# Altium schematic sheet CPCIS_Connectors_P1_P6.SchDoc: DIOT Connector
size 420 x 297 mm; DrawnBy: G.K.; Organization: WUT; DocumentNumber: 1; SheetNumber: 6; SheetTotal: 10; ModifiedBy: M. Beldyga; Title2: CPCIS Connectors; Designer: G.K.; SPICEModelCacheRMUUFYQV: <root> / <DocumentId>RMUUFYQV</DocumentId> / </root>; ModifiedDate: -; Rule: PcbType=ProtelPcb
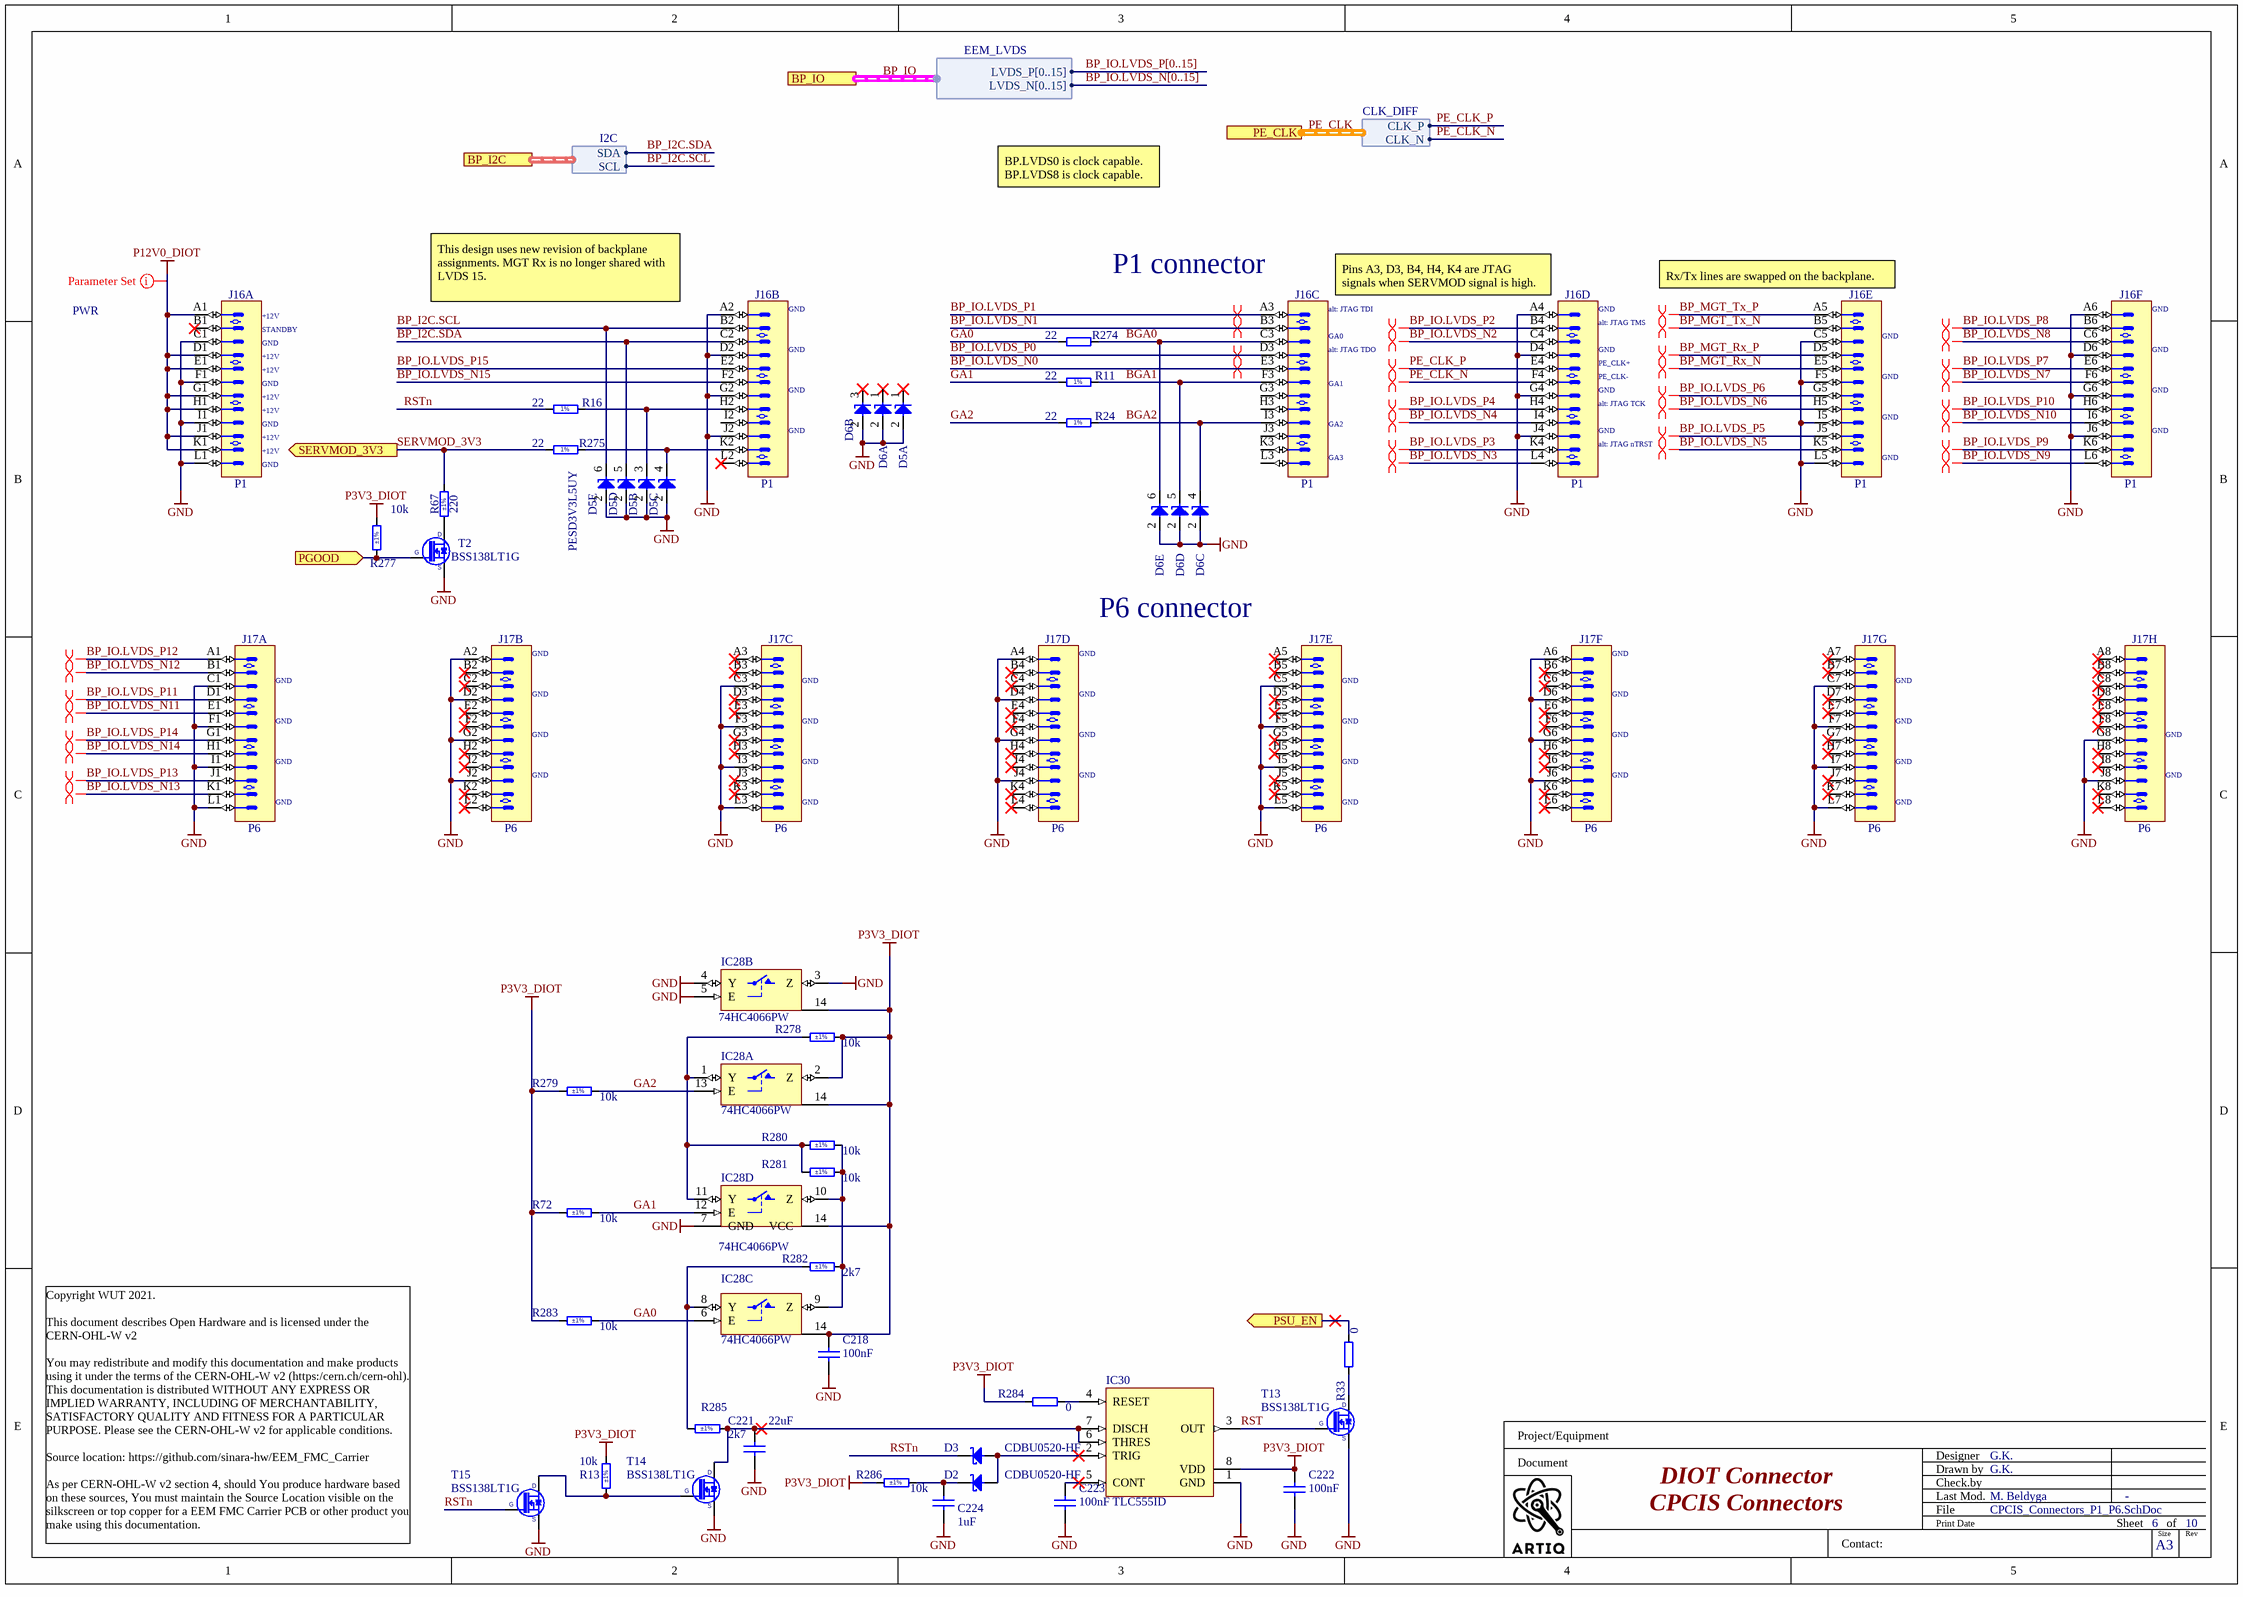
[diagram p0: CPCIS_Connectors_P1_P6.SchDoc]

## Parts
C218  100nF  [CAPC1608X87N]
C221  22uF  [CAPC2012X135N]
C222  100nF  [CAPC1608X87N]
C223  100nF  [CAPC1608X87N]
C224  1uF  [CAPC1608X87N]
D2  CDBU0520-HF  [SOD-523F]
D3  CDBU0520-HF  [SOD-523F]
D5  PESD3V3L5UY  [SOT65P210X110-6N]  (value not drawn)  (parts A,B,C,D,E of 5)
D6  PESD3V3L5UY  [SOT65P210X110-6N]  (value not drawn)  (parts A,B,C,D,E of 5)
IC28  74HC4066PW  [SOP65P640X110-14N]  (parts A,B,C,D of 4)
IC30  TLC555ID  [SOIC127P600X175-8N]
J16  P1  [AMPHENOL_10052825-101LF]  (parts A,B,C,D,E,F of 6)
J17  P6  [AMPHENOL_10052838-101LF]  (parts A,B,C,D,E,F,G,H of 8)
R11  22  [RESC1005X40N]
R13  10k  Tolerance: ±1%  [RESC1608X55N]
R16  22  [RESC1005X40N]
R24  22  [RESC1005X40N]
R33  0  [RESC1608X55N]
R67  220  Tolerance: ±1%  [RESC1005X40N]
R72  10k  Tolerance: ±1%  [RESC1608X55N]
R274  22  [RESC1005X40N]
R275  22  [RESC1005X40N]
R277  10k  Tolerance: ±1%  [RESC1608X55N]
R278  10k  Tolerance: ±1%  [RESC1608X55N]
R279  10k  Tolerance: ±1%  [RESC1608X55N]
R280  10k  Tolerance: ±1%  [RESC1608X55N]
R281  10k  Tolerance: ±1%  [RESC1608X55N]
R282  2k7  Tolerance: ±1%  [RESC1608X55N]
R283  10k  Tolerance: ±1%  [RESC1608X55N]
R284  0  [RESC1608X55N]
R285  2k7  Tolerance: ±1%  [RESC1608X55N]
R286  10k  Tolerance: ±1%  [RESC1608X55N]
T2  BSS138LT1G  [SOT95P240X110-3N]
T13  BSS138LT1G  [SOT95P240X110-3N]
T14  BSS138LT1G  [SOT95P240X110-3N]
T15  BSS138LT1G  [SOT95P240X110-3N]

## Ports
BP_I2C (harness I2C), BP_IO (harness EEM_LVDS), PE_CLK (harness CLK_DIFF), PGOOD (in), PSU_EN (out), SERVMOD_3V3 (out)

## Harnesses
CLK_DIFF: CLK_N, CLK_P
I2C: SDA, SCL
EEM_LVDS: LVDS_P[0..15], LVDS_N[0..15]

## Nets
GND: C218.1 C221.1 C222.1 C223.1 C224.1 D5.2(A) D6.2(A) IC28.3(Z) IC28.4(Y) IC28.5(E) IC28.7(GND) IC30.1(GND) J16.A2 J16.A4 J16.A6 J16.C1 J16.C5 J16.D2 J16.D4 J16.D6 J16.F1 J16.F5 J16.G2 J16.G4 J16.G6 J16.I1 J16.I5 J16.J2 J16.J4 J16.J6 J16.L1 J16.L5 J17.A2 J17.A4 J17.A6 J17.C1 J17.C3 J17.C5 J17.C7 J17.D2 J17.D4 J17.D6 J17.F1 J17.F3 J17.F5 J17.F7 J17.G2 J17.G4 J17.G6 J17.G8 J17.I1 J17.I3 J17.I5 J17.I7 J17.J2 J17.J4 J17.J6 J17.J8 J17.L1 J17.L3 J17.L5 J17.L7 T2.2(S) T13.2(S) T14.2(S) T15.2(S)
P3V3_DIOT: C218.2 C222.2 IC28.2(Z) IC28.14(VCC) IC30.8(VDD) R13.2 R72.1 R277.2 R278.2 R279.1 R283.1 R284.1 R286.1
P12V0_DIOT: J16.A1 J16.D1 J16.E1 J16.G1 J16.H1 J16.J1 J16.K1
BGA0: D6.6(C) J16.C3 R274.2
BGA1: D6.5(C) J16.F3 R11.2
BGA2: D6.4(C) J16.I3 R24.2
BP_I2C.SCL: D5.6(C) J16.B2 ; port BP_I2C.SCL
BP_I2C.SDA: D5.5(C) J16.C2 ; port BP_I2C.SDA
BP_IO.LVDS_N0: J16.E3
BP_IO.LVDS_N1: J16.B3
BP_IO.LVDS_N2: J16.C4
BP_IO.LVDS_N3: J16.L4
BP_IO.LVDS_N4: J16.I4
BP_IO.LVDS_N5: J16.K5
BP_IO.LVDS_N6: J16.H5
BP_IO.LVDS_N7: J16.F6
BP_IO.LVDS_N8: J16.C6
BP_IO.LVDS_N9: J16.L6
BP_IO.LVDS_N10: J16.I6
BP_IO.LVDS_N11: J17.E1
BP_IO.LVDS_N12: J17.B1
BP_IO.LVDS_N13: J17.K1
BP_IO.LVDS_N14: J17.H1
BP_IO.LVDS_N15: J16.F2
BP_IO.LVDS_P0: J16.D3
BP_IO.LVDS_P1: J16.A3
BP_IO.LVDS_P2: J16.B4
BP_IO.LVDS_P3: J16.K4
BP_IO.LVDS_P4: J16.H4
BP_IO.LVDS_P5: J16.J5
BP_IO.LVDS_P6: J16.G5
BP_IO.LVDS_P7: J16.E6
BP_IO.LVDS_P8: J16.B6
BP_IO.LVDS_P9: J16.K6
BP_IO.LVDS_P10: J16.H6
BP_IO.LVDS_P11: J17.D1
BP_IO.LVDS_P12: J17.A1
BP_IO.LVDS_P13: J17.J1
BP_IO.LVDS_P14: J17.G1
BP_IO.LVDS_P15: J16.E2
BP_MGT_Rx_N: J16.E5
BP_MGT_Rx_P: J16.D5
BP_MGT_Tx_N: J16.B5
BP_MGT_Tx_P: J16.A5
GA0: IC28.6(E) R274.1 R283.2
GA1: IC28.12(E) R11.1 R72.2
GA2: IC28.13(E) R24.1 R279.2
PE_CLK_N: J16.F4 ; port PE_CLK.CLK_N  [project net PE_CLK.CLK_N]
PE_CLK_P: J16.E4 ; port PE_CLK.CLK_P  [project net PE_CLK.CLK_P]
PGOOD: R277.1 T2.1(G) ; port PGOOD
PSU_EN: R33.2 ; port PSU_EN
RST: IC30.3(OUT) T13.1(G)
RSTn: D3.1(C) R16.1 T15.1(G)
SERVMOD_3V3: R67.2 R275.1 ; port SERVMOD_3V3
NetC221_2: C221.2 IC30.6(THRES) IC30.7(DISCH) R285.2 T14.3(D)
NetC223_2: C223.2 IC30.5(CONT)
NetC224_2: C224.2 D2.1(C) R286.2
NetD2_2: D2.2(A) D3.2(A) IC30.2(TRIG)
NetD5_3: D5.3(C) J16.H2 R16.2
NetD5_4: D5.4(C) J16.K2 R275.2
NetIC28_1: IC28.1(Y) IC28.11(Y) R278.1 R280.1 R281.1
NetIC28_8: IC28.8(Y) R282.1 R285.1
NetIC28_9: IC28.9(Z) IC28.10(Z) R280.2 R281.2 R282.2
NetIC30_4: IC30.4(RESET) R284.2
NetR13_1: R13.1 T14.1(G) T15.3(D)
NetR33_1: R33.1 T13.3(D)
NetR67_1: R67.1 T2.3(D)

Not connected (* = marked no-connect by the designer): D5 1(C)*; D6 1(C)* 3(C)*; J16 B1* G3 H3 I2 J3 K3 L2* L3; J17 A3* A5* A7* A8* B2* B3* B4* B5* B6* B7* B8* C2* C4* C6* C8* D3* D5* D7* D8* E2* E3* E4* E5* E6* E7* E8* F2* F4* F6* F8* G3* G5* G7* H2* H3* H4* H5* H6* H7* H8* I2* I4* I6* I8* J3* J5* J7* K2* K3* K4* K5* K6* K7* K8* L2* L4* L6* L8*

## Buses and harness runs
bus BP_IO.LVDS_N[0..15]
bus BP_IO.LVDS_P[0..15]
harness BP_IO = port BP_IO
harness PE_CLK = port PE_CLK

## Layout directives
differential pair: BP_IO.LVDS_N0, BP_IO.LVDS_N1, BP_IO.LVDS_N2, BP_IO.LVDS_N3, BP_IO.LVDS_N4, BP_IO.LVDS_N5, BP_IO.LVDS_N6, BP_IO.LVDS_N7, BP_IO.LVDS_N8, BP_IO.LVDS_N9, BP_IO.LVDS_N10, BP_IO.LVDS_N11, BP_IO.LVDS_N12, BP_IO.LVDS_N13, BP_IO.LVDS_N14, BP_IO.LVDS_P0, BP_IO.LVDS_P1, BP_IO.LVDS_P2, BP_IO.LVDS_P3, BP_IO.LVDS_P4, BP_IO.LVDS_P5, BP_IO.LVDS_P6, BP_IO.LVDS_P7, BP_IO.LVDS_P8, BP_IO.LVDS_P9, BP_IO.LVDS_P10, BP_IO.LVDS_P11, BP_IO.LVDS_P12, BP_IO.LVDS_P13, BP_IO.LVDS_P14
differential pair; differential pair class Diff_100Ohm: PE_CLK.CLK_N, PE_CLK.CLK_P
differential pair; differential pair class MGT: BP_MGT_Rx_N, BP_MGT_Rx_P, BP_MGT_Tx_N, BP_MGT_Tx_P
net class PWR: P12V0_DIOT

## Notes on the sheet
- BP.LVDS0 is clock capable.
  BP.LVDS8 is clock capable.
- (near J16) +12V
- This design uses new revision of backplane assignments. MGT Rx is no longer shared with LVDS 15.
- (near J16) GND
- (near J16) P1 connector
- (near J16) alt: JTAG TDI
- (near J16) Pins A3, D3, B4, H4, K4 are JTAG signals when SERVMOD signal is high.
- (near J16) alt: JTAG TMS
- (near J16) Rx/Tx lines are swapped on the backplane.
- (near J16) STANDBY
- GND
- (near J16) alt: JTAG TDO
- (near J16) GA1
- (near J16) GA0
- (near J16) PE_CLK+
- (near J16) PE_CLK-
- (near J16) GA2
- (near J16) GA3
- (near J16) alt: JTAG TCK
- (near J16) alt: JTAG nTRST
- (near J17) GND
- (near J17) P6 connector
- Project/Equipment
- Document
- Designer
- Drawn by
- Check.by
- Copyright WUT 2021.
  This document describes Open Hardware and is licensed under the CERN-OHL-W v2
  You may redistribute and modify this documentation and make products using it under the terms of the CERN-OHL-W v2 (https:/cern.ch/cern-ohl). This documentation is distributed WITHOUT ANY EXPRESS OR IMPLIED WARRANTY, INCLUDING OF MERCHANTABILITY, SATISFACTORY QUALITY AND FITNESS FOR A PARTICULAR PURPOSE. Please see the CERN-OHL-W v2 for applicable conditions.
  Source location: https://github.com/sinara-hw/EEM_FMC_Carrier
  As per CERN-OHL-W v2 section 4, should You produce hardware based on these sources, You must maintain the Source Location visible on the silkscreen or top copper for a EEM FMC Carrier PCB or other product you make using this documentation.
- Contact:
- File
- Last Mod.
- Print Date
- Sheet
- Size
- A3
- of
- Rev
- (in symbol R0402_22R_1%_0.0625W_100PPM) 1%

## Library data of the parts
C218 C222 C223 = CC0603_100NF_50V_10%_X7R: Non-polarised capacitor; Part Description: SMD Multilayer Chip Ceramic Capacitor; Manufacturer: GENERIC; Manufacturer1 Part Number: 223858615649; Voltage: 50V; TC: X7R; Tolerance: ±10%; Part Number: CC0603_100NF_50V_10%_X7R; Component Kind: Standard; Component Type: Standard; Pin Count: 2; Value: 100nF; Status: Preferred; Manufacturer Part Number: CC0603_100NF_50V_10%_X7R; Case: 0603; Mounted: Yes; Socket: No; SMD: Yes; Sense: No; Manufacturer1 Example: PHYCOMP; Manufacturer1 ComponentHeight: 0.87mm; HelpURL: \\cern.ch\dfs\Applications\Altium\Datasheets\CC0603_X7R_PHYCOMP.pdf; Author: CERN DEM JLC; CreateDate: 03.12.2007; LatestRevisionDate: 03.12.2007
C221 = CC0805_22UF_16V_10%_X5R: Non-polarised capacitor; Part Description: SMD Multilayer Chip Ceramic Capacitor; Manufacturer: GENERIC; Manufacturer1 Part Number: C2012X5R1C226KT; Voltage: 16V; TC: X5R; Tolerance: ±10%; Part Number: CC0805_22UF_16V_10%_X5R; Component Kind: Standard; Component Type: Standard; Pin Count: 2; Value: 22uF; Status: Preferred; Manufacturer Part Number: CC0805_22UF_16V_10%_X5R; Case: 0805; Mounted: Yes; Socket: No; SMD: Yes; Sense: No; Manufacturer1 Example: TDK; Manufacturer1 ComponentHeight: 1.35mm; HelpURL: \\cern.ch\dfs\Applications\Altium\Datasheets\CC0805_X5R_TDK_C.pdf; Author: CERN DEM JLC; CreateDate: 25.10.2012; LatestRevisionDate: 25.10.2012
C224 = CC0603_1UF_16V_10%_X7R: Non-polarised capacitor; Part Description: SMD Multilayer Chip Ceramic Capacitor; Manufacturer: GENERIC; Manufacturer1 Part Number: 223878615663; Voltage: 16V; TC: X7R; Tolerance: ±10%; Part Number: CC0603_1UF_16V_10%_X7R; Component Kind: Standard; Component Type: Standard; Pin Count: 2; Value: 1uF; Status: None; Manufacturer Part Number: CC0603_1UF_16V_10%_X7R; Case: 0603; Mounted: Yes; Socket: No; SMD: Yes; Sense: No; Manufacturer1 Example: YAGEO PHYCOMP; Manufacturer1 ComponentHeight: 0.9mm; HelpURL: \\cern.ch\dfs\Applications\Altium\Datasheets\CC0603_X7R_PHYCOMP.pdf; Author: CERN DEM JLC; CreateDate: 03.12.2007; LatestRevisionDate: 17.04.2015
D2 D3 = CDBU0520-HF: Schottky Diode; Part Description: 20V Surface mount Schottky Barrier Diode; Manufacturer: COMCHIP; Voltage: 20V; Power: 500mA; PressFit: No; Bonding: No; Part Number: CDBU0520-HF; Component Kind: Standard; Component Type: Standard; Device: CDBU0520-HF; PackageDescription: Small Outline Diode Flat Lead (SOD-523F), Body; 1.80mm L X 1mm W X 0.85mm H; Manufacturer Part Number: CDBU0520-HF; Pin Count: 2; Case: SOD-523F; Mounted: Yes; Socket: No; SMD: Yes; Sense: No; ComponentHeight: 1mm; HelpURL: \\cern.ch\dfs\Applications\Altium\Datasheets\CDBU0520-HF.pdf; Author: CERN DEM HF; CreateDate: 13.10.2023; LatestRevisionDate: 13.10.2023
D5 D6 = PESD3V3L5UY: Fivefold ESD Protection Diode Arrays; Part Description: Fivefold ESD Protection Diode Arrays (30kV); Manufacturer: NEXPERIA; Voltage: 3.3V; Power: 200W; PressFit: No; Bonding: No; Part Number: PESD3V3L5UY; Component Kind: Standard; Component Type: Standard; Device: PESD3V3L5UY; PackageDescription: SOT363, SC-88, 0.65mm Pitch; 6 Pin, 1.25mm W X 2.00mm L X 1.10mm H body, IPC Medium Density; Manufacturer Part Number: PESD3V3L5UY; Pin Count: 6; Case: SOT363; Mounted: Yes; Socket: No; SMD: Yes; Sense: No; ComponentHeight: 1.1mm; HelpURL: \\cern.ch\dfs\Applications\Altium\Datasheets\PESD3V3L5UY.pdf; Author: CERN DEM WB; CreateDate: 05.07.2021; LatestRevisionDate: 05.07.2021
IC28 = 74HC4066PW: Part Description: Quad Single-Pole Single-Throw Analog Switch; Manufacturer: NXP SEMICONDUCTORS; PressFit: No; Bonding: No; Table: Standard Logic; Part Number: 74HC4066PW; Component Kind: Standard; Component Type: Standard; Device: 74HC4066PW; PackageDescription: SOP, 14-Leads, Body 4.4x5mm (max), Pitch 0.65mm, IPC Medium Density; Manufacturer Part Number: 74HC4066PW; Pin Count: 14; Case: TSSOP14; Mounted: Yes; Socket: No; SMD: Yes; ComponentHeight: 1.1mm; Author: CERN DEM JLC; HelpURL: \\cern.ch\dfs\Applications\Altium\Datasheets\74HC4066PW.pdf; CreateDate: 2014-11-19; LatestRevisionDate: 2014-11-19
IC30 = TLC555ID: LinCMOS Timer; Manufacturer: TEXAS INSTRUMENTS; PressFit: No; Bonding: No; Part Number: TLC555ID; Component Kind: Standard; Component Type: Standard; Device: TLC555ID; PackageDescription: SOIC 8, Pitch 1.27mm, Body 4x5mm, IPC Medium Density; Part Description: LinCMOS Timer; Manufacturer Part Number: TLC555ID; Pin Count: 8; Case: SOIC8; Mounted: Yes; Socket: No; SMD: Yes; Sense: No; ComponentHeight: 1.75mm; Author: CERN DEM JMW; HelpURL: \\cern.ch\dfs\Applications\Altium\Datasheets\TLC555ID.pdf; CreateDate: 23.08.2016; LatestRevisionDate: 23.08.2016
J16 = AMPHENOL_10052825-101LF: 72 Contacts Header, 6 Columns, 4 Pairs per Column; Part Description: 72 Contacts, 2mm Pitch, 6 Columns, 4 Pairs per Column, 4 Walls, Right Angle Header; Part Number: AMPHENOL_10052825-101LF; Component Kind: Standard; Component Type: Standard; Pin Count: 72; Family: AirMax VS; Mounted: Yes; Socket: No; SMD: No; PressFit: Yes; Sense: No; Status: None; Manufacturer: AMPHENOL; Manufacturer Part Number: 10052825-101LF; ComponentHeight: 15.35mm; HelpURL: \\cern.ch\dfs\Applications\Altium\Datasheets\AMPHENOL_10052825-101LF.pdf; ComponentLink1URL: \\cern.ch\dfs\Applications\Altium\Datasheets\AMPHENOL_10052825-101LF_Application.pdf; ComponentLink1Description: Application; Author: CERN DEM MR; CreateDate: 19/02/2018; LatestRevisionDate: 19/02/2018; Classname: Overlapping
J17 = AMPHENOL_10052838-101LF: 96 Contacts Header, 8 Columns, 4 Pairs per Column; Part Description: 96 Contacts, 2mm Pitch, 8 Columns, 4 Pairs per Column, 4 Walls, Right Angle Header; Part Number: AMPHENOL_10052838-101LF; Component Kind: Standard; Component Type: Standard; Pin Count: 96; Family: AirMax VS; Mounted: Yes; Socket: No; SMD: No; PressFit: Yes; Sense: No; Status: None; Manufacturer: AMPHENOL; Manufacturer Part Number: 10052838-101LF; ComponentHeight: 15.35mm; HelpURL: \\cern.ch\dfs\Applications\Altium\Datasheets\AMPHENOL_10052838-101LF.pdf; ComponentLink1URL: \\cern.ch\dfs\Applications\Altium\Datasheets\AMPHENOL_10052838-101LF_Application.pdf; ComponentLink1Description: Application; Author: CERN DEM MR; CreateDate: 19.02.2018; LatestRevisionDate: 19.02.2018
R11 R16 R24 R274 R275 = R0402_22R_1%_0.0625W_100PPM: Resistor - 1%; Part Description: General Purpose Thick Film Chip Resistor; Manufacturer: GENERIC; Manufacturer1 Part Number: 232270672209L; PressFit: No; Part Number: R0402_22R_1%_0.0625W_100PPM; Component Kind: Standard; Component Type: Standard; Pin Count: 2; Value: 22; Status: Not Recommended; Power: 0.0625W; Tolerance: ±1%; Manufacturer Part Number: R0402_22R_1%_0.0625W_100PPM; Case: 0402; Mounted: Yes; Socket: No; SMD: Yes; Manufacturer1 Example: YAGEO PHYCOMP; Manufacturer1 ComponentHeight: 0.4mm; HelpURL: \\cern.ch\dfs\Applications\Altium\Datasheets\R0402_Phycomp_RC0402.pdf; Author: CERN DEM JLC; CreateDate: 03.12.2007; LatestRevisionDate: 17.10.2012; Sense: No
R13 R72 R277-R281 R283 R286 = R0603_10K_1%_0.1W_100PPM: Resistor - 1%; Part Description: General Purpose Thick Film Chip Resistor; Manufacturer: GENERIC; Manufacturer1 Part Number: NRC06F1002TRF; Power: 0.1W; TC: ±100ppm/°C; PressFit: No; Part Number: R0603_10K_1%_0.1W_100PPM; Component Kind: Standard; Component Type: Standard; Pin Count: 2; Value: 10k; Status: Preferred; Manufacturer Part Number: R0603_10K_1%_0.1W_100PPM; Case: 0603; Mounted: Yes; Sense: No; Socket: No; SMD: Yes; Manufacturer1 Example: NIC COMPONENT; Manufacturer1 ComponentHeight: 0.55mm; HelpURL: \\cern.ch\dfs\Applications\Altium\Datasheets\R0603_NIC_NRC.pdf; Author: CERN DEM JLC; CreateDate: 03.12.2007; LatestRevisionDate: 13.03.2008
R33 R284 = R0603_0R_JUMPER: Resistor; Part Description: 1A (0.05R Max DC Resistance) Zero Ohm Jumper; Manufacturer: GENERIC; Manufacturer1 Part Number: NRC06Z0; PressFit: No; Part Number: R0603_0R_JUMPER; Component Kind: Standard; Component Type: Standard; Pin Count: 2; Value: 0; Status: Preferred; Manufacturer Part Number: R0603_0R_JUMPER; Case: 0603; Mounted: Yes; Sense: No; Socket: No; SMD: Yes; Manufacturer1 Example: NIC COMPONENT; Manufacturer1 ComponentHeight: 0.55mm; HelpURL: \\cern.ch\dfs\Applications\Altium\Datasheets\R0603_NIC_NRC.pdf; Author: CERN DEM JLC; CreateDate: 03.12.2007; LatestRevisionDate: 13.03.2008
R67 = R0402_220R_1%_0.0625W_100PPM: Resistor - 1%; Part Description: General Purpose Thick Film Chip Resistor; Manufacturer: GENERIC; Manufacturer1 Part Number: 232270672201L; TC: ±100ppm/°C; PressFit: No; Part Number: R0402_220R_1%_0.0625W_100PPM; Component Kind: Standard; Component Type: Standard; Pin Count: 2; Value: 220; Status: Not Recommended; Power: 0.0625W; Manufacturer Part Number: R0402_220R_1%_0.0625W_100PPM; Case: 0402; Mounted: Yes; Sense: No; Socket: No; SMD: Yes; Manufacturer1 Example: YAGEO PHYCOMP; Manufacturer1 ComponentHeight: 0.4mm; HelpURL: \\cern.ch\dfs\Applications\Altium\Datasheets\R0402_Phycomp_RC0402.pdf; Author: CERN DEM JLC; CreateDate: 03.12.2007; LatestRevisionDate: 17.10.2012
R282 R285 = R0603_2K7_1%_0.1W_100PPM: Resistor - 1%; Part Description: General Purpose Thick Film Chip Resistor; Manufacturer: GENERIC; Manufacturer1 Part Number: RC0603FR-072K7L; Power: 0.1W; TC: ±100ppm/°C; PressFit: No; Part Number: R0603_2K7_1%_0.1W_100PPM; Component Kind: Standard; Component Type: Standard; Pin Count: 2; Value: 2k7; Status: Preferred; Manufacturer Part Number: R0603_2K7_1%_0.1W_100PPM; Case: 0603; Mounted: Yes; Sense: No; Socket: No; SMD: Yes; Manufacturer1 Example: YAGEO PHYCOMP; Manufacturer1 ComponentHeight: 0.55mm; HelpURL: \\cern.ch\dfs\Applications\Altium\Datasheets\R0603_PHYCOMP_RC0603.pdf; Author: CERN DEM JLC; CreateDate: 02.05.2011; LatestRevisionDate: 02.05.2011
T2 T13-T15 = BSS138LT1G: N-CHANNEL MOSFET WITH DIODE; Part Description: 50V, 200mA N-Channel Enhancement Mode Field-Effect Transistor; Manufacturer: ON SEMICONDUCTOR; PressFit: No; Bonding: No; Part Number: BSS138LT1G; Component Kind: Standard; Component Type: Standard; Device: BSS138LT1G; PackageDescription: SOT23, 0.95mm Pitch; 3 Pin, 1.40mm W X 3.00mm L X 1.10mm H body, IPC Medium Density; Manufacturer Part Number: BSS138L; Pin Count: 3; Case: SOT23-3; Mounted: Yes; Socket: No; SMD: Yes; Sense: No; ComponentHeight: 1.11mm; HelpURL: \\cern.ch\dfs\Applications\Altium\Datasheets\BSS138LT1G.pdf; Author: CERN DEM JLC; CreateDate: 23.03.2009; LatestRevisionDate: 25.05.2022